# EAGLE design ESP_LoRa_ScaleSansotta (EAGLE 9.5.2)
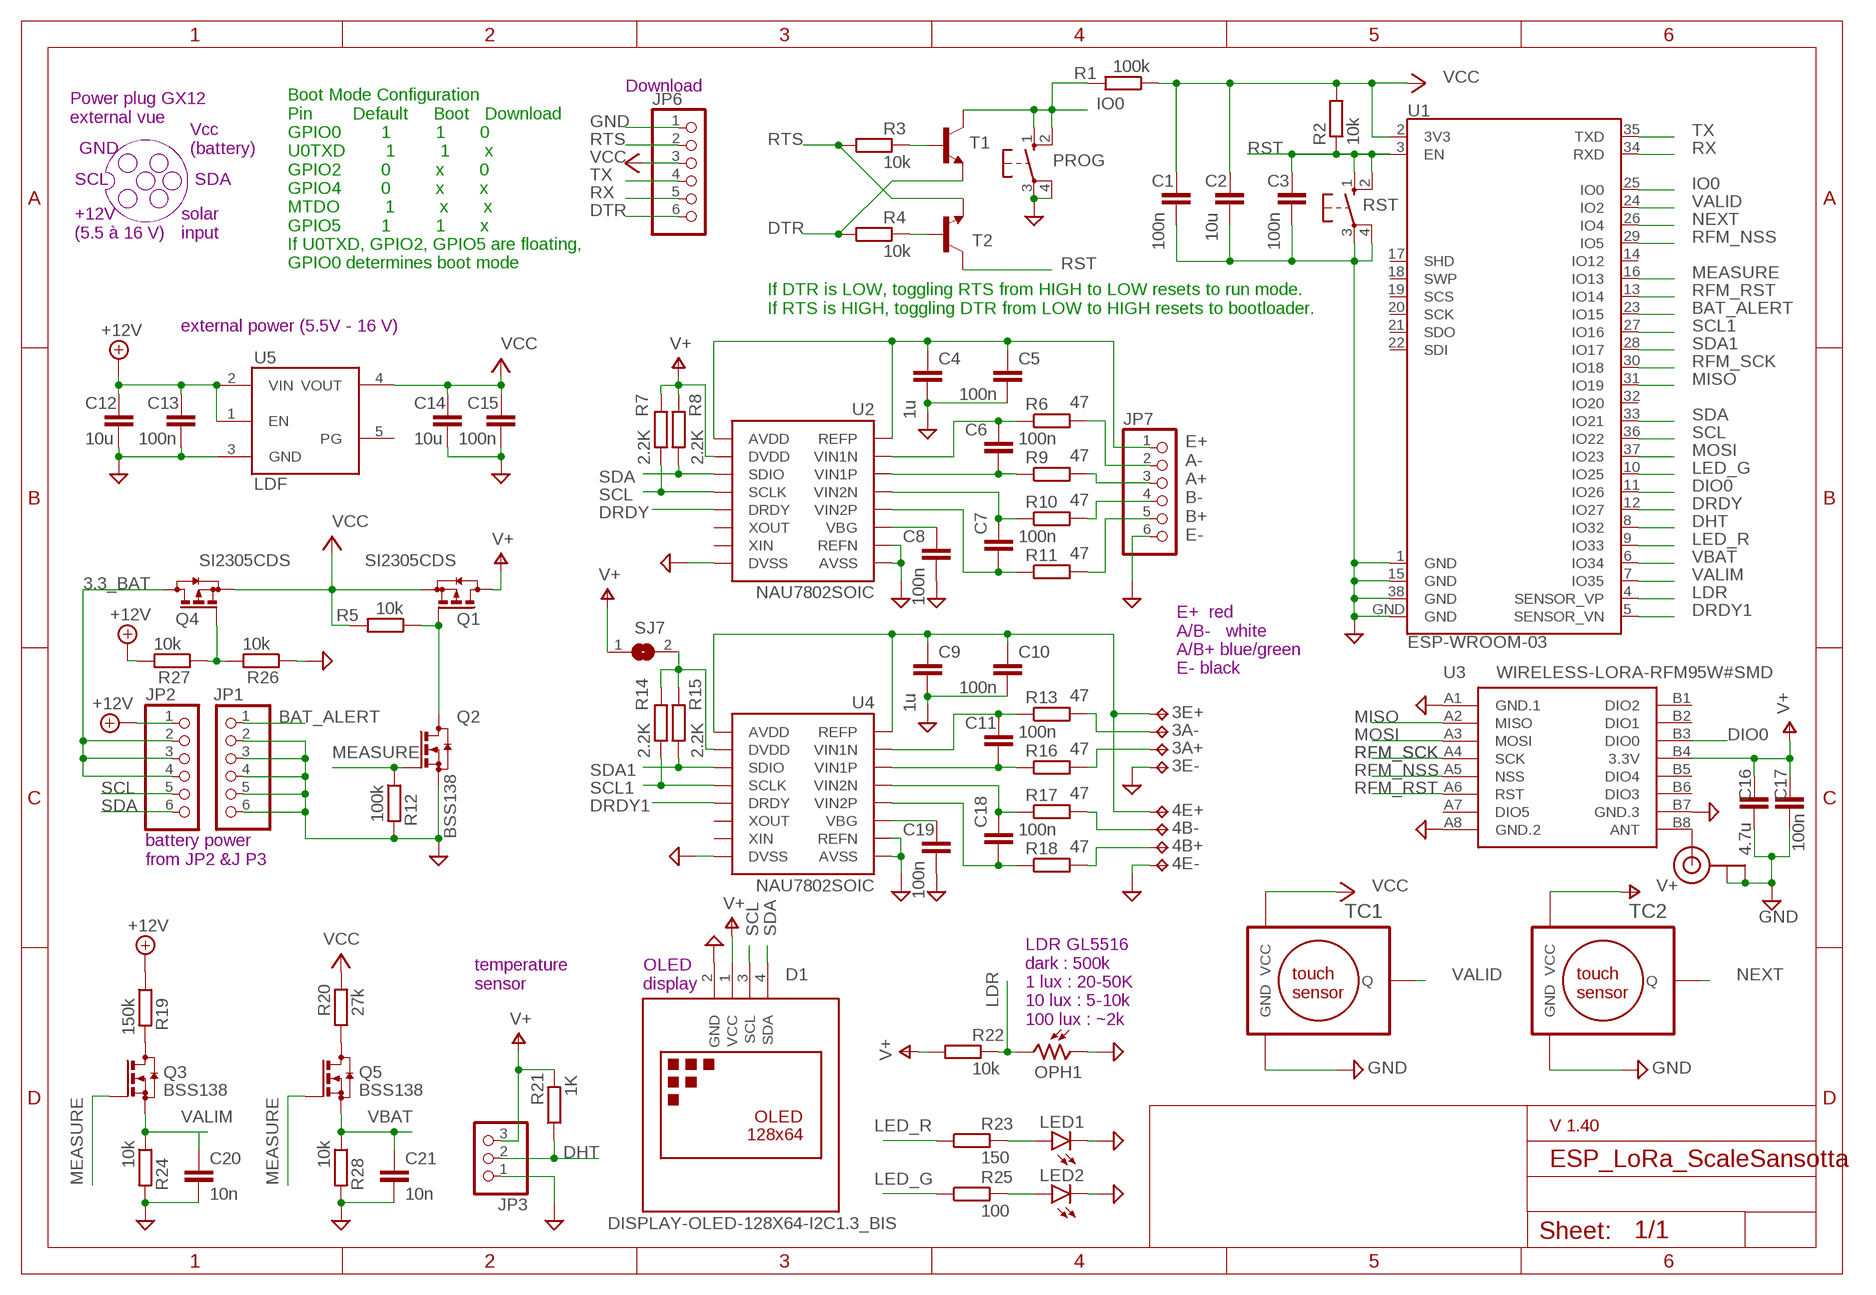
[diagram p0: schematic, sheet 1]

## Parts
3A+  TPTP17SQ  [TP17SQ]
3A-  TPTP17SQ  [TP17SQ]
3E+  TPTP17SQ  [TP17SQ]
3E-  TPTP17SQ  [TP17SQ]
4B+  TPTP17SQ  [TP17SQ]
4B-  TPTP17SQ  [TP17SQ]
4E+  TPTP17SQ  [TP17SQ]
4E-  TPTP17SQ  [TP17SQ]
C1  100n  CC1206  [C1206]
C2  10u  CC1210  [C1210]
C3  100n  CC1206  [C1206]
C4  1u  CC1210  [C1210]
C5  100n  CC1206  [C1206]
C6  100n  CC1206  [C1206]
C7  100n  CC1206  [C1206]
C8  100n  CC1206  [C1206]
C9  1u  CC1210  [C1210]
C10  100n  CC1206  [C1206]
C11  100n  CC1206  [C1206]
C12  10u  CC1210  [C1210]
C13  100n  CC1206  [C1206]
C14  10u  CC1210  [C1210]
C15  100n  CC1206  [C1206]
C16  4.7u  CC1210  [C1210]
C17  100n  CC1206  [C1206]
C18  100n  CC1206  [C1206]
C19  100n  CC1206  [C1206]
C20  10n  CC1206  [C1206]
C21  10n  CC1206  [C1206]
D1  DISPLAY-OLED-128X64-I2C1.3_BIS  [DISPLAY-OLED-128X64-1.3-I2C_BIS]
J1  U.FL  [U.FL]
JP1  PINHD-1X6  [1X06]
JP2  PINHD-1X6  [1X06]
JP3  PINHD-1X3  [1X03]
JP6  PINHD-1X6  [1X06]
JP7  PINHD-1X6  [1X06]
LED1  LEDSMT1206  [1206]
LED2  LEDSMT1206  [1206]
OPH1  VT93N2  [VT900]
PROG  10-XX  [B3F-10XX]
Q1  SI2305CDS  [SOT23]
Q2  BSS138  [SOT23]
Q3  BSS138  [SOT23]
Q4  SI2305CDS  [SOT23]
Q5  BSS138  [SOT23]
R1  100k  RR1206  [R1206]
R2  10k  RR1206  [R1206]
R3  10k  RR1206  [R1206]
R4  10k  RR1206  [R1206]
R5  10k  RR1206  [R1206]
R6  47  RR1206  [R1206]
R7  2.2K  RR1206  [R1206]
R8  2.2K  RR1206  [R1206]
R9  47  RR1206  [R1206]
R10  47  RR1206  [R1206]
R11  47  RR1206  [R1206]
R12  100k  RR1206  [R1206]
R13  47  RR1206  [R1206]
R14  2.2K  RR1206  [R1206]
R15  2.2K  RR1206  [R1206]
R16  47  RR1206  [R1206]
R17  47  RR1206  [R1206]
R18  47  RR1206  [R1206]
R19  150k  RR1206  [R1206]
R20  27k  RR1206  [R1206]
R21  1K  RR1206  [R1206]
R22  10k  RR1206  [R1206]
R23  150  RR1206  [R1206]
R24  10k  RR1206  [R1206]
R25  100  RR1206  [R1206]
R26  10k  RR1206  [R1206]
R27  10k  RR1206  [R1206]
R28  10k  RR1206  [R1206]
RST  10-XX  [B3F-10XX]
SJ7  SJ  [SJ]
T1  MMBT2222ALT1-NPN-SOT23-BEC  [SOT23-BEC]
T2  MMBT2222ALT1-NPN-SOT23-BEC  [SOT23-BEC]
TC1  TTP223R_H  [TTP233RED_H]
TC2  TTP223R_H  [TTP233RED_H]
U1  ESP-WROOM-03  [ESP-WROOM-03]
U2  NAU7802SOIC  [SO16]
U3  WIRELESS-LORA-RFM95W#SMD  [WIRELESS-LORA-RFM95W#SMD]
U4  NAU7802SOIC  [SO16]
U5  LDF3.3  [PPAK]

## Nets
3.3_BAT: JP2.2 JP2.3 JP2.4 Q4.3(D)
+12V: C12.1 C13.1 JP2.1 R19.1 R27.2 U5.1(EN) U5.2(VIN)
BAT_ALERT: JP1.1 U1.23(IO15)
DHT: JP3.2 R21.1 U1.8(IO32)
DIO0: U1.11(IO26) U3.B3(DIO0)
DRDY: U1.12(IO27) U2.12(DRDY)
DRDY1: U1.5(SENSOR_VN) U4.12(DRDY)
DTR: JP6.6 R4.1 T1.E
GND: 3E-.TP 4E-.TP C1.2 C2.2 C3.2 C4.2 C5.2 C8.2 C9.2 C10.2 C12.2 C13.2 C14.2 C15.2 C16.2 C17.2 C19.2 C20.2 C21.2 D1.2(GND) J1.1(GND) J1.2(GND) JP1.2 JP1.3 JP1.4 JP1.5 JP1.6 JP3.1 JP6.1 JP7.6 LED1.C LED2.C OPH1.1 PROG.3(P) PROG.4(P1) Q2.2(S) R12.2 R24.2 R26.1 R28.2 RST.3(P) RST.4(P1) TC1.P$3(GND) TC2.P$3(GND) U1.1(GND) U1.15(GND) U1.38(GND) U1.GND U2.7(REFN) U2.8(AVSS) U2.9(DVSS) U3.A1(GND.1) U3.A8(GND.2) U3.B7(GND.3) U4.7(REFN) U4.8(AVSS) U4.9(DVSS) U5.3(GND)
IO0: PROG.1(S) PROG.2(S1) R1.2 T1.C U1.25(IO0)
LDR: OPH1.2 R22.2 U1.4(SENSOR_VP)
LED_G: R25.1 U1.10(IO25)
LED_R: R23.1 U1.9(IO33)
MEASURE: Q2.1(G) Q3.1(G) Q5.1(G) R12.1 U1.16(IO13)
MISO: U1.31(IO19) U3.A2(MISO)
MOSI: U1.37(IO23) U3.A3(MOSI)
N$1: Q1.1(G) Q2.3(D) R5.1
N$2: Q3.3(D) R19.2
N$3: J1.3(SIGNAL) U3.B8(ANT)
N$4: R14.2 R15.2 SJ7.2 U4.15(DVDD)
N$5: Q5.3(D) R20.1
N$7: LED1.A R23.2
N$8: LED2.A R25.2
N$10: R3.2 T1.B
N$13: JP7.2 R6.2
N$14: R4.2 T2.B
N$15: C8.1 U2.6(VBG)
N$16: C19.1 U4.6(VBG)
N$17: C11.2 R16.1 U4.3(VIN1P)
N$18: C11.1 R13.1 U4.2(VIN1N)
N$19: C6.2 R9.1 U2.3(VIN1P)
N$20: C6.1 R6.1 U2.2(VIN1N)
N$21: C7.1 R10.1 U2.4(VIN2N)
N$22: C7.2 R11.1 U2.5(VIN2P)
N$24: JP7.3 R9.2
N$25: JP7.5 R11.2
N$26: JP7.4 R10.2
N$27: C18.1 R17.1 U4.4(VIN2N)
N$28: C18.2 R18.1 U4.5(VIN2P)
N$29: 4B+.TP R18.2
N$30: 4B-.TP R17.2
N$31: 3E+.TP 4E+.TP C9.1 C10.1 U4.1(REFP) U4.16(AVDD)
N$32: 3A-.TP R13.2
N$33: 3A+.TP R16.2
N$34: C4.1 C5.1 JP7.1 U2.1(REFP) U2.16(AVDD)
N$35: Q4.1(G) R26.2 R27.1
NEXT: TC2.P$2(Q) U1.26(IO4)
RFM_NSS: U1.29(IO5) U3.A5(NSS)
RFM_RST: U1.13(IO14) U3.A6(RST)
RFM_SCK: U1.30(IO18) U3.A4(SCK)
RST: C3.1 R2.1 RST.1(S) RST.2(S1) T2.C U1.3(EN)
RTS: JP6.2 R3.1 T2.E
RX: JP6.5 U1.34(RXD)
SCL: D1.3(SCL) JP2.5 R7.1 U1.36(IO22) U2.13(SCLK)
SCL1: R14.1 U1.27(IO16) U4.13(SCLK)
SDA: D1.4(SDA) JP2.6 R8.1 U1.33(IO21) U2.14(SDIO)
SDA1: R15.1 U1.28(IO17) U4.14(SDIO)
TX: JP6.4 U1.35(TXD)
V+: C16.1 C17.1 D1.1(VCC) JP3.3 Q1.3(D) R7.2 R8.2 R21.2 R22.1 SJ7.1 TC2.P$1(VCC) U2.15(DVDD) U3.B4(3.3V)
VALID: TC1.P$2(Q) U1.24(IO2)
VALIM: C20.1 Q3.2(S) R24.1 U1.7(IO35)
VBAT: C21.1 Q5.2(S) R28.1 U1.6(IO34)
VCC: C1.1 C2.1 C14.1 C15.1 JP6.3 Q1.2(S) Q4.2(S) R1.1 R2.2 R5.2 R20.2 TC1.P$1(VCC) U1.2(3V3) U5.4(VOUT)
Unconnected: U1.14(IO12) U1.17(SHD) U1.18(SWP) U1.19(SCS) U1.20(SCK) U1.21(SDO) U1.22(SDI) U1.32(IO20) U2.10(XIN) U2.11(XOUT) U3.A7(DIO5) U3.B1(DIO2) U3.B2(DIO1) U3.B5(DIO4) U3.B6(DIO3) U4.10(XIN) U4.11(XOUT) U5.5(PG)

## Notes on the sheet
- Download
- Power plug GX12
  external vue
- GND
- Vcc
  (battery)
- SCL | SDA
- +12V
  (5.5 à 16 V)
- solar 
  input
- Boot Mode Configuration
  Pin        Default     Boot   Download
  GPIO0        1         1       0
  U0TXD        1         1       x
  GPIO2        0         x       0
  GPIO4        0         x       x
  MTDO         1         x       x
  GPIO5        1         1       x
  If U0TXD, GPIO2, GPIO5 are floating, 
  GPIO0 determines boot mode
- If DTR is LOW, toggling RTS from HIGH to LOW resets to run mode.
  If RTS is HIGH, toggling DTR from LOW to HIGH resets to bootloader.
- external power (5.5V - 16 V)
- E+
  A-
  A+
  B-
  B+
  E-
- E+  red
  A/B-   white
  A/B+ blue/green
  E- black
- battery power
  from JP2 &J P3
- temperature
  sensor
- OLED 
  display
- LDR GL5516
  dark : 500k
  1 lux : 20-50K
  10 lux : 5-10k
  100 lux : ~2k
- V 1.40

## Library data of the parts
3A+ 3A- 3E+ 3E- 4B+ 4B- 4E+ 4E- = testpad:TP: Test pad
C1-C21 = eagle-ltspice:C: CAPACITOR, European symbol; SPICEMODEL: NONE; SPICEPREFIX: C
D1 = diy-modules1.8-perso:DISPLAY-OLED-128X64-I2C: 128x64 Dot Matrix OLED Module based on SSD1306 chip Variant with I2C interface More details available here: http://www.instructables.com/id/Monochrome-096-i2c-OLED-display-with-arduino-SSD13/ SSD1306 datasheet: https://cdn-shop.adafruit.com/datasheets/SSD1306.pdf Click here to find device on ebay.com <http://www.ebay.com/sch/oled+display+128x64+iic> Note: There are two variants: I2C and SPI. Search for the proper version.
J1 = microbuilder:U.FL: U.FL Antenna Connector
JP1 JP2 JP6 JP7 = pinhead:PINHD-1X6: PIN HEADER
JP3 = pinhead:PINHD-1X3: PIN HEADER
LED1 LED2 = led:LED: LED OSRAM: - CHIPLED LG R971, LG N971, LY N971, LG Q971, LY Q971, LO R971, LY R971 LH N974, LH R974 LS Q976, LO Q976, LY Q976 LO Q996 - Hyper CHIPLED LW Q18S LB Q993, LB Q99A, LB R99A - SideLED LS A670, LO A670, LY A670, LG A670, LP A670 LB A673, LV A673, LT A673, LW A673 LH A674 LY A675 LS A676, LA A676, LO A676, LY A676, LW A676 LS A679, LY A679, LG A679 - Hyper Micro SIDELED® LS Y876, LA Y876, LO Y876, LY Y876 LT Y87S - SmartLED LW L88C, LW L88S LB L89C, LB L89S, LG L890 LS L89K, LO L89K, LY L89K LS L896, LA L896, LO L896, LY L896 - TOPLED LS T670, LO T670, LY T670, LG T670, LP T670 LSG T670, LSP T670, LSY T670, LOP T670, LYG T670 LG T671, LOG T671, LSG T671 LB T673, LV T673, LT T673, LW T673 LH T674 LS T676, LA T676, LO T676, LY T676, LB T676, LH T676, LSB T676, LW T676 LB T67C, LV T67C, LT T67C, LS T67K, LO T67K, LY T67K, LW E67C LS E67B, LA E67B, LO E67B, LY E67B, LB E67C, LV E67C, LT E67C LW T67C LS T679, LY T679, LG T679 LS T770, LO T770, LY T770, LG T770, LP T770 LB T773, LV T773, LT T773, LW T773 LH T774 LS E675, LA E675, LY E675, LS T675 LS T776, LA T776, LO T776, LY T776, LB T776 LHGB T686 LT T68C, LB T68C - Hyper Mini TOPLED® LB M676 - Mini TOPLED Santana® LG M470 LS M47K, LO M47K, LY M47K Source: http://www.osram.convergy.de LUXEON: - LUMILED® LXK2-PW12-R00, LXK2-PW12-S00, LXK2-PW14-U00, LXK2-PW14-V00 LXK2-PM12-R00, LXK2-PM12-S00, LXK2-PM14-U00 LXK2-PE12-Q00, LXK2-PE12-R00, LXK2-PE12-S00, LXK2-PE14-T00, LXK2-PE14-U00 LXK2-PB12-K00, LXK2-PB12-L00, LXK2-PB12-M00, LXK2-PB14-N00, LXK2-PB14-P00, LXK2-PB14-Q00 LXK2-PR12-L00, LXK2-PR12-M00, LXK2-PR14-Q00, LXK2-PR14-R00 LXK2-PD12-Q00, LXK2-PD12-R00, LXK2-PD12-S00 LXK2-PH12-R00, LXK2-PH12-S00 LXK2-PL12-P00, LXK2-PL12-Q00, LXK2-PL12-R00 Source: www.luxeon.com KINGBRIGHT: KA-3528ASYC Source: www.kingbright.com
OPH1 = photo-elements:VT9: Photoconductive Cell VT900 Series Source: http://optoelectronics.perkinelmer.com/content/Datasheets/DTS_vt900seriesdatasheet.pdf
PROG RST = switch-omron:10-XX: OMRON SWITCH; MPN: B3F-1000; OC_FARNELL: 176432; OC_NEWARK: 36M3542
Q1 Q4 = transistor-small-signal-perso:SI2305CDS: P-CHANNEL MOS FET
Q2 Q3 Q5 = detect:BSS138: N-CHANNEL MOS FET
R1-R28 = eagle-ltspice:R: RESISTOR, European symbol; SPICEMODEL: NONE; SPICEPREFIX: R
SJ7 = jumper:SJ: SMD solder JUMPER
T1 T2 = transistor:*-NPN-: NPN Transistror BF959 corrected 2008.03.06
TC1 TC2 = esp32-lora:TTP223: Touch Key Switch
U1 = esp32-sparkfun (1):ESP-WROOM-03; OC_FARNELL: unknown
U2 U4 = SparkFun-IC-Conversion:NAU7802: 24-bit load cell conversion IC with I2C interface in SOIC-16 package. Similar to HX711 but with true I2C interface.; PROD_ID: IC-14299
U3 = diy-modules:WIRELESS-LORA-RFM95W: 868/915 MHz LoRa Radio Transceiver Module based on SX1276 chip Click here to find device on ebay.com <http://www.ebay.com/sch/RFM95W+transceiver>
U5 = LDO:LDF: LDFxx 1 A very low drop voltage regulator

## Board
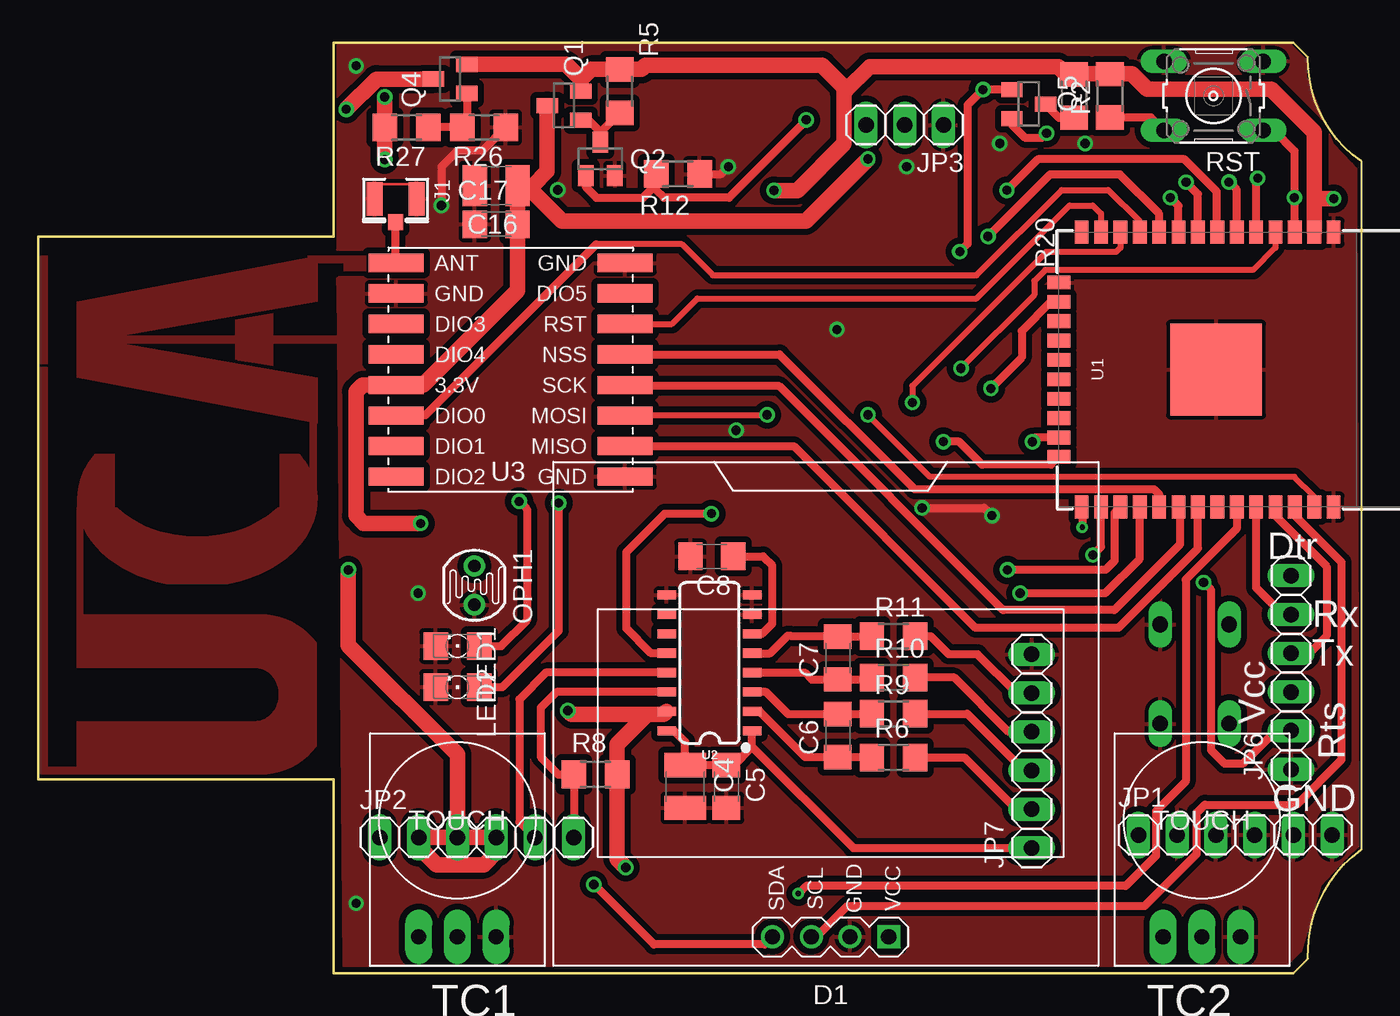
[diagram p1: board, top side]
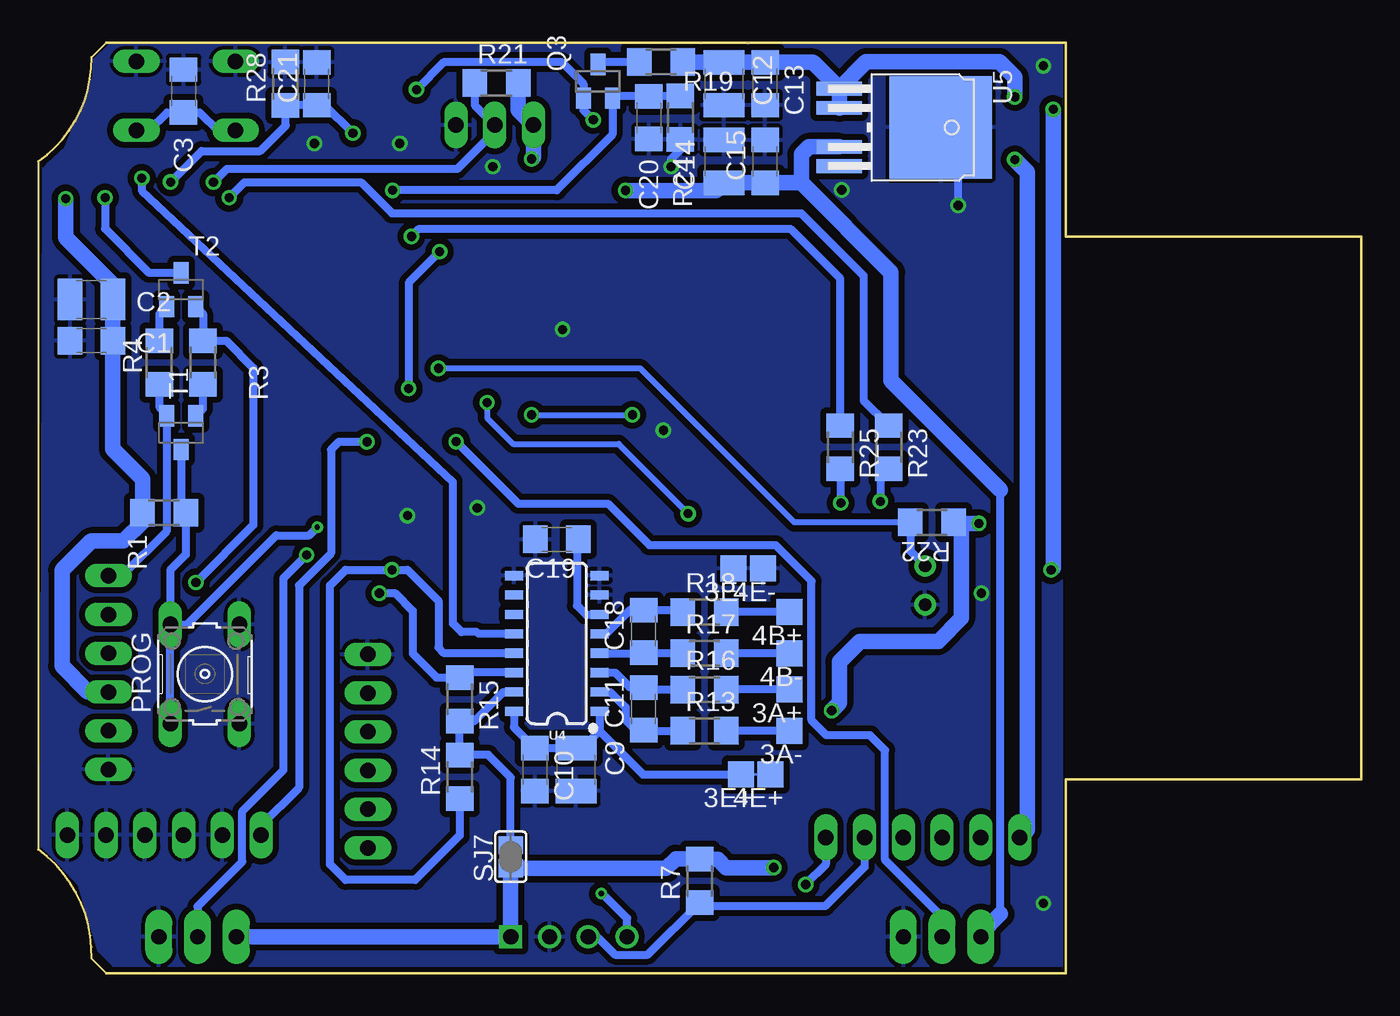
[diagram p2: board, bottom side, seen from below]

Size 86.68 x 60.96 mm. Coordinates in mm from the lower left corner, seen from the top.
Outline: 19.37,0 19.37,12.7 0,12.7 0,48.26 19.37,48.26 19.37,60.96 82.23,60.96 83.19,60.01 arc56 86.68,53.18 86.68,8.1 arc56 83.19,0.95 82.23,0 19.37,0
Copper layers (1*16): Top 0.035mm / dielectric 1.5mm / Bottom 0.035mm
Design rules "default *": minimum track width 6mil, minimum drill 0.35mm, track to track 6mil, track to pad 6mil, pad to pad 6mil, via to via 6mil, smd to smd 6mil, copper to edge 0mil, drill to drill 6mil, minimum pad ring 10mil, minimum via ring 8mil, stop-mask expansion 4mil, vias tented up to drill 0mil, thermal gap 10mil

### Footprints (pad centres in the part's own frame; a part is rotated, then mirrored left to right if it is on the bottom)
TP17SQ = smd 1.7 x 1.7: TP 0,0
C1206 = smd 1.6 x 1.8: 1 -1.4,0; 2 1.4,0
C1210 = smd 1.6 x 2.7: 1 -1.4,0; 2 1.4,0
DISPLAY-OLED-128X64-1.3-I2C_BIS = drill 1 square: 1 -3.81,14.605 | drill 1: 2 -1.27,14.605; 3 1.27,14.605; 4 3.81,14.605
U.FL = smd 2.2 x 1.05: 1 0,1.375; 2 0,-1.375 | smd 1.05 x 1: 3 1.525,0
1X06 = drill 1.016 long: 1 -6.35,0; 2 -3.81,0; 3 -1.27,0; 4 1.27,0; 5 3.81,0; 6 6.35,0
1X03 = drill 1.016 long: 1 -2.54,0; 2 0,0; 3 2.54,0
1206 = smd 1.6 x 1.803: A -1.422,0; C 1.422,0
VT900 = drill 0.8 pad 1.4: 1 -1.27,0; 2 1.27,0
B3F-10XX = drill 1.016 long: 1 -3.251,2.261; 2 3.251,2.261; 3 -3.251,-2.261; 4 3.251,-2.261
SOT23 = smd 1 x 1.4: 1 -0.95,-1.1; 2 0.95,-1.1; 3 0,1.1
R1206 = smd 1.6 x 1.803: 1 -1.422,0; 2 1.422,0
SJ = smd 1.168 x 1.6: 1 -0.762,0; 2 0.762,0
SOT23-BEC = smd 1 x 1.4: B -0.95,-1.1; C 0,1.1; E 0.95,-1.1
TTP233RED_H = drill 1 pad 1.778 long: P$1 1.905,2.54; P$2 1.905,0; P$3 1.905,-2.54
ESP-WROOM-03 = smd 0.9 x 1.5: 1 7.7,9; 2 6.43,9; 3 5.16,9; 4 3.89,9; 5 2.62,9; 6 1.35,9; 7 0.08,9; 8 -1.19,9; 9 -2.46,9; 10 -3.73,9; 11 -5,9; 12 -6.27,9; 13 -7.54,9; 14 -8.81,9; 25 -8.81,-9; 26 -7.54,-9; 27 -6.27,-9; 28 -5,-9; 29 -3.73,-9; 30 -2.46,-9; 31 -1.19,-9; 32 0.08,-9; 33 1.35,-9; 34 2.62,-9; 35 3.89,-9; 36 5.16,-9; 37 6.43,-9; 38 7.7,-9 | smd 1.5 x 0.9: 15 -10.3,5.715; 16 -10.3,4.445; 17 -10.3,3.175; 18 -10.3,1.905; 19 -10.3,0.635; 20 -10.3,-0.635; 21 -10.3,-1.905; 22 -10.3,-3.175; 23 -10.3,-4.445; 24 -10.3,-5.715 | smd 6 x 6: GND 0,0
SO16 = smd 0.6 x 1.2: 1 -4.445,-2.8; 2 -3.175,-2.8; 3 -1.905,-2.8; 4 -0.635,-2.8; 5 0.635,-2.8; 6 1.905,-2.8; 7 3.175,-2.8; 8 4.445,-2.8; 9 4.445,2.8; 10 3.175,2.8; 11 1.905,2.8; 12 0.635,2.8; 13 -0.635,2.8; 14 -1.905,2.8; 15 -3.175,2.8; 16 -4.445,2.8
WIRELESS-LORA-RFM95W#SMD = smd 3.6 x 1.2: A1 -7.5,7; A2 -7.5,5; A3 -7.5,3; A4 -7.5,1; A5 -7.5,-1; A6 -7.5,-3; A7 -7.5,-5; A8 -7.5,-7; B1 7.5,7; B2 7.5,5; B3 7.5,3; B4 7.5,1; B5 7.5,-1; B6 7.5,-3; B7 7.5,-5; B8 7.5,-7
PPAK = smd 0.9 x 3: 1 -2.54,-1.5; 2 -1.27,-1.5; 4 1.27,-1.5; 5 2.54,-1.5 | smd 6.7 x 6.7: 3 0,5.15

### Placement (x,y rotation side)
3A+  37.47,18.57 180 bottom
3A-  37.47,15.88 180 bottom
3E+  40.64,13.02 180 bottom
3E-  41.12,26.51 180 bottom
4B+  37.47,23.65 180 bottom
4B-  37.47,20.95 180 bottom
4E+  38.69,13.02 180 bottom
4E-  39.21,26.51 180 bottom
C1  83.19,41.43 180 bottom
C2  83.19,44.13 180 bottom
C3  77.15,57.78 90 bottom
C4  42.39,12.22 270 top
C5  45.09,12.22 270 top
C6  52.39,15.56 90 top
C7  52.39,20.64 90 top
C8  44.13,27.3 180 top
C9  51.44,13.34 270 bottom
C10  54.13,13.34 270 bottom
C11  47.02,17.3 90 bottom
C12  41.75,58.26 270 bottom
C13  39.05,58.26 270 bottom
C14  41.75,53.18 90 bottom
C15  39.05,53.18 90 bottom
C16  30,51.59 180 top
C17  30,49.05 180 top
C18  47.02,22.38 90 bottom
C19  52.7,28.42 180 bottom
C20  46.67,56.04 270 bottom
C21  68.42,58.26 90 bottom
D1  51.91,16.99 180 top
J1  23.41,50.73 270 top
JP1  78.42,9.05 0 top
JP2  28.73,8.89 0 top
JP3  56.77,55.56 180 top
JP6  82.07,19.68 90 top
JP7  65.09,14.54 90 top
LED1  27.46,21.43 180 top
LED2  27.46,18.73 180 top
OPH1  28.57,25.4 90 top
PROG  75.76,19.59 90 bottom
Q1  34.45,56.83 90 top
Q2  36.83,53.34 0 top
Q3  50.01,58.42 0 bottom
Q4  26.99,58.58 90 top
Q5  64.89,56.93 270 top
R1  78.42,30.16 0 bottom
R2  70.2,57.47 90 top
R3  75.88,40.01 270 bottom
R4  78.74,40.01 90 bottom
R5  38.1,57.78 90 top
R6  56.04,14.13 0 top
R7  43.34,6.03 90 bottom
R8  36.51,13.02 0 top
R9  56.04,16.99 0 top
R10  56.04,19.37 0 top
R11  56.04,22.07 0 top
R12  41.91,52.36 0 top
R13  43.02,15.88 0 bottom
R14  59.05,12.86 90 bottom
R15  59.05,17.94 270 bottom
R16  43.02,18.57 0 bottom
R17  43.02,20.95 0 bottom
R18  43.02,23.65 0 bottom
R19  45.88,59.69 180 bottom
R20  67.86,57.46 90 top
R21  56.66,58.3 0 bottom
R22  28.13,29.53 180 bottom
R23  30.96,34.45 270 bottom
R24  44.61,56.04 270 bottom
R25  34.13,34.45 270 bottom
R26  29.21,55.4 180 top
R27  24.13,55.4 180 top
R28  70.48,58.26 90 bottom
RST  76.99,57.47 180 top
SJ7  55.72,7.62 90 bottom
T1  77.31,35.4 180 bottom
T2  77.31,44.77 0 bottom
TC1  27.46,0.48 90 top
TC2  76.23,0.48 90 top
U1  77.16,39.54 0 top
U2  43.97,20.32 90 top
U3  30.96,39.53 180 top
U4  52.7,21.59 90 bottom
U5  32.7,55.4 270 bottom

### Tracks (layer width: path | path; a pad name or v marks a point on that pad's centre or on a via)
3.3_BAT  (via drill 0.6)
  Top 1.016: JP2.3 JP2.2 24.92,8.28 26.1,7.1 29.2,7.1 30,7.9 JP2.4 JP2.3 | v20.18,56.59 22.17,58.58 Q4.3 | JP2.3 27.46,14.33 20.32,21.47 v20.32,26.42
  Bottom 0.508: 20.18,26.55 v20.32,26.42
  Bottom 1.016: v20.18,56.59 20.18,26.55
+12V  (via drill 0.6)
  Top 0.152: 22.7,55.37 R27.2
  Top 1.016: v22.7,57.4 R27.2 | v22.7,53.3 22.7,55.37
  Bottom 0.152: 41.66,59.66 C12.1
  Bottom 0.508: C12.1 41.78,59.69
  Bottom 1.016: 41.78,59.69 R19.1 | 41.66,59.66 C13.1 35.92,59.66 U5.1 | U5.1 U5.2 | U5.1 32.45,59.7 23.7,59.7 22.7,58.7 v22.7,57.4 | JP2.1 21.88,9.4 21.88,52.48 v22.7,53.3
ANT
  pour Top: 14.99,13 0.14,13 0.14,39.7 0.64,39.7 0.64,13.5 2.54,13.5 2.54,16.5 14.19,16.5 14.32,16.51 14.46,16.53 14.59,16.56 14.73,16.61 14.85,16.67 14.97,16.74 15.09,16.82 15.2,16.91 15.3,17.02 15.39,17.13 15.48,17.25 15.55,17.38 15.61,17.51 15.67,17.65 15.71,17.8 15.74,17.95 15.76,18.1 15.76,18.25 15.76,18.41 15.74,18.56 15.71,18.71 15.67,18.85 15.61,18.99 15.55,19.13 15.48,19.25 15.39,19.38 15.3,19.49 15.2,19.59 15.09,19.69 14.97,19.77 14.85,19.84 14.73,19.9 14.59,19.94 14.46,19.98 14.32,20 14.19,20 2.54,20 2.54,30.5 2.57,30.5 2.55,31.11 2.61,31.73 2.75,32.32 2.99,32.92 3.31,33.49 3.72,34 5.03,34 5.03,30.5 5.17,30.5 5.5,30.21 5.85,29.95 6.22,29.7 6.63,29.48 7.06,29.27 7.5,29.1 7.96,28.95 8.44,28.82 8.92,28.73 9.42,28.66 9.92,28.61 10.42,28.6 10.92,28.61 11.42,28.66 11.92,28.73 12.41,28.82 12.88,28.95 13.35,29.1 13.78,29.27 14.21,29.48 14.62,29.7 14.99,29.95 15.34,30.21 15.67,30.5 15.82,30.5 15.82,34 17.13,34 17.25,33.85 17.37,33.69 17.49,33.53 17.59,33.37 17.69,33.21 17.79,33.04 17.79,36.1 2.54,39 2.54,44 17.64,46.87 17.64,47 20.14,47 20.14,46.99 23.99,46.99 23.99,45.99 19.99,45.99 19.99,46.5 18.31,46.5 18.31,44 5.61,41.75 12.91,41.75 12.91,42.8 15.4,43.25 15.4,41.75 19.99,41.75 19.99,42 20.39,42 20.39,41 19.99,41 19.99,41.25 15.4,41.25 15.4,39.75 14.21,39.97 13.08,40.14 13.08,40.17 12.91,40.2 12.91,41.25 5.61,41.25 18.31,39 18.31,36 18.24,36.02 18.24,31.76 18.3,31.22 18.29,30.67 18.21,30.13 18.06,29.58 17.83,29.06 17.55,28.56 17.18,28.07 16.76,27.62 16.3,27.2 15.76,26.8 15.17,26.46 14.57,26.15 13.89,25.88 13.2,25.66 12.49,25.5 8.35,25.5 7.75,25.64 7.15,25.81 6.57,26.03 6.03,26.27 5.51,26.54 5.02,26.85 4.58,27.18 4.16,27.53 3.79,27.92 3.47,28.32 3.19,28.74 2.95,29.18 2.95,23.5 14.99,23.5 14.99,23.49 15.4,23.43 15.81,23.34 16.21,23.21 16.59,23.03 16.96,22.82 17.31,22.58 17.65,22.3 17.96,21.99 18.24,21.65 18.24,14.85 17.96,14.52 17.65,14.2 17.31,13.93 16.96,13.68 16.59,13.47 16.21,13.3 15.81,13.17 15.4,13.07 14.99,13.02
ANT1
  pour Top: 0.64,39.9 0.14,39.9 0.14,47 0.64,47
BAT_ALERT  (via drill 0.6)
  Top 0.508: U1.23 65.34,35.09 65.14,34.89 v65.14,34.81
  Bottom 0.508: JP1.1 72.07,9.66 69.6,12.14 69.6,25.4 67.5,27.5 67.5,34.3 66.99,34.81 v65.14,34.81
DHT  (via drill 0.6)
  Top 0.508: U1.8 75.97,51.03 v75.19,51.82
  Bottom 0.508: R21.1 58.08,56.87 JP3.2 56.77,55.13 59.22,52.68 74.33,52.68 v75.19,51.82
DIO0
  Top 0.152: U1.11 72.16,48.26
  Top 0.406: 72.16,48.26 72.16,49.25 70.1,51.31 67.06,51.31 61.47,45.72 44.2,45.72 42.16,47.75 36.58,47.75
  Top 0.508: U3.B3 25.35,36.53 36.58,47.75
DRDY  (via drill 0.6)
  Top 0.406: U1.12 70.89,47.52 70.61,47.24 66.04,47.24 57.27,38.47 v57.27,37.38
  Top 0.508: U2.12 40.16,20.95 38.51,22.6 38.51,27.56 41.05,30.1 v44.1,30.1
  Bottom 0.406: v57.27,37.38 57.27,36.36 55.57,34.66 48.65,34.66 44.1,30.12 v44.1,30.1
DRDY1  (via drill 0.6)
  Top 0.508: U1.5 79.78,51.97 v79.89,52.08
  Bottom 0.152: 57.81,22.23 57.93,22.34
  Bottom 0.508: U4.12 57.81,22.23 | 57.93,22.34 58.94,22.34 59.51,22.9 59.51,32.17 79.89,51.27 v79.89,52.08
DTR
  Bottom 0.508: R4.1 78.74,37.08 78.26,36.6 T1.E 78.26,28.95 81.17,26.04 JP6.6
GND  (via drill 0.6)
  Top 0.152: J1.2 22.51,51.2 22.51,51.65 22.56,51.69 24.27,51.69 24.32,51.65 24.32,51.2 J1.1
  Top 0.508: R26.1 29.11,53.88 27.46,53.88 26.42,52.83 v26.42,50.29 | R12.2 44.74,52.36 v45.21,52.83 | v57.91,30.48 61.98,30.48 v62.48,29.97
  Bottom 0.152: 44.57,54.58 R24.2
  Bottom 0.508: U5.3 26.42,54.27 v26.42,50.29 | v45.21,52.83 45.21,53.34 44.57,53.98 44.57,54.58
  other vias: 45.72,35.56 24.89,24.89 56.9,52.83 20.83,4.57 52.32,42.16 62.99,54.36 20.83,59.44 34.04,51.31 68.58,54.36
  pour Top (isolate 0.406): 20.01,0.48 19.61,45.09 19.6,45.1 19.6,45.5 19.7,45.6 25.7,45.6 25.7,47.4 19.6,47.4 19.6,47.43 19.6,60.8 82.07,60.8 83.03,59.85 83.03,58.74 84.78,54.36 86.04,53.02 86.36,52.7 86.48,8.3 85.69,7.56 83.98,5.71 82.71,1.43 81.76,0.48
  pour Bottom (isolate 0.406): 19.6,0.48 19.6,60.9 81.97,60.9 83.03,59.85 83.03,58.74 84.87,54.12 86.04,53.02 86.36,52.7 86.48,8.3 85.69,7.56 83.98,5.71 82.71,1.43 81.76,0.48
IO0  (via drill 0.35)
  Top 0.508: U1.25 68.4,30.49 v68.4,29.2
  Bottom 0.152: 78.02,22.78 PROG.2
  Bottom 0.508: T1.C 77.31,30.47 R1.2 77,27.41 78.02,26.4 PROG.2 76.92,22.84 71.08,28.68 68.92,28.68 v68.4,29.2 | PROG.1 78.02,22.78
LDR  (via drill 0.6)
  Top 0.406: U1.4 81.05,47.52 79.58,46.06 65.97,46.06 65.25,45.34 65.25,44.42 v60.45,39.62
  Bottom 0.406: R22.2 37.15,29.53 47.24,39.62 v60.45,39.62
  Bottom 0.508: R22.2 29.55,27.65 OPH1.2
LED_G  (via drill 0.6)
  Top 0.508: U1.10 73.43,49.75 70.86,52.32 66.29,52.32 v62.22,48.26
  Bottom 0.508: R25.1 34.13,45.49 37.41,48.77 61.72,48.77 v62.22,48.26
LED_R  (via drill 0.6)
  Top 0.508: v74.17,50.8 74.7,50.27 U1.9
  Bottom 0.508: R23.1 32.61,37.52 32.61,45.68 36.71,49.78 63.5,49.78 65.53,51.82 73.15,51.82 v74.17,50.8
MEASURE  (via drill 0.6)
  Top 0.508: Q5.1 v61.9,57.88 v61.89,57.88 60.88,56.88 60.88,47.78 v60.38,47.27 | v50.31,55.9 50.31,55.84 45.27,50.8 41,50.8 40.49,51.31 40.49,51.66 | Q2.1 35.88,51.5 36.58,50.8 39.62,50.8 40.49,51.66 | U1.16 66.36,43.98 64.44,42.07 64.44,40.34 v62.41,38.3 | 40.49,51.66 R12.1
  Bottom 0.508: v60.38,47.27 62.41,45.24 v62.41,38.3 | v61.89,57.88 60.08,59.7 52.4,59.7 50.96,58.26 Q3.1 50.96,56.54 v50.31,55.9
MISO
  Top 0.508: U3.A2 49.5,34.53 61.41,22.62 70.77,22.62 75.97,27.83 U1.31
MOSI  (via drill 0.6)
  Top 0.406: U1.37 83.59,31.21 82.3,32.51 58.42,32.51 v54.36,36.58 | v47.75,36.58 47.7,36.53 U3.A3
  Bottom 0.406: v54.36,36.58 v47.75,36.58
N$1
  Top 0.508: R5.1 36.83,55.09 | 36.83,55.09 Q2.3 | Q1.1 36.04,55.88 36.83,55.09
N$2
  Bottom 0.508: R19.2 49.84,59.69 Q3.3
N$3
  Top 0.508: U3.B8 23.41,46.57 J1.3
N$4
  Bottom 0.152: 59.04,14.3 R14.2 | U4.15 56.19,18.41 | 59.04,16.5 R15.2
  Bottom 0.508: SJ7.2 55.72,12.82 57.2,14.3 59.04,14.3 | R14.2 R15.2 | 56.19,18.41 58.11,16.5 59.04,16.5
N$5
  Top 0.508: R20.1 66.88,56.04 Q5.3
N$7  (via drill 0.6)
  Top 0.508: v31.51,30.9 32.02,30.39 32.02,23.12 30.33,21.43 LED1.A
  Bottom 0.152: R23.2 31.51,32.48
  Bottom 0.508: 31.51,32.48 v31.51,30.9
N$8  (via drill 0.6)
  Top 0.508: v34.1,30.8 34.1,22.42 30.41,18.73 LED2.A
  Bottom 0.508: R25.2 34.13,30.83 v34.1,30.8
N$10
  Bottom 0.508: R3.2 75.88,36.98 T1.B
N$13
  Top 0.508: R6.2 60.67,14.13 64.07,10.73 JP7.2
N$14
  Bottom 0.508: T2.B 78.74,43.19 R4.2
N$15
  Top 0.508: C8.1 47.49,27.3 48.1,26.7 48.1,22.9 47.42,22.23 U2.6
N$16
  Bottom 0.152: C19.1 51.38,28.34
  Bottom 0.508: 51.38,28.34 51.38,24.08 50.8,23.5 U4.6
N$17
  Bottom 0.152: 47.06,18.75 C11.2 46.89,18.57
  Bottom 0.508: 46.89,18.57 R16.1 | U4.3 48.88,19.68 47.95,18.75 47.06,18.75
N$18
  Bottom 0.152: C11.1 46.99,15.88
  Bottom 0.508: 46.99,15.88 R13.1 | U4.2 49.21,18.41 48.2,17.41 48.2,16.6 47.5,15.9 C11.1
N$19
  Top 0.152: R9.1 54.59,16.96
  Top 0.508: U2.3 47.69,18.41 49.14,16.96 C6.2 54.59,16.96
N$20
  Top 0.152: 54.59,14.16 R6.1
  Top 0.508: 54.59,14.16 C6.1 50.24,14.16 47.26,17.14 U2.2
N$21
  Top 0.152: 54.49,19.24 R10.1
  Top 0.508: U2.4 50.22,19.68 50.66,19.24 C7.1 54.49,19.24
N$22
  Top 0.152: 49.1,22.1 49.28,22.1 | C7.2 52.36,22.06 R11.1
  Top 0.508: 49.1,22.1 47.95,20.95 U2.5 | 49.28,22.1 52.33,22.1 52.36,22.06 | C7.2 52.42,22.07 R11.1
N$24
  Top 0.508: R9.2 60.87,16.99 64.58,13.27 JP7.3
N$25
  Top 0.508: JP7.5 64.07,18.35 61.53,20.89 59.65,20.89 58.48,22.07 R11.2
N$26
  Top 0.508: JP7.4 63.56,15.81 60.01,19.37 R10.2
N$27
  Bottom 0.152: 44.47,20.98 R17.1 | 47.05,20.95 C18.1
  Bottom 0.508: C18.1 44.47,20.98 | U4.4 47.05,20.95
N$28
  Bottom 0.152: 44.57,23.78 R18.1 | 47.04,23.8 C18.2
  Bottom 0.508: C18.2 44.57,23.78 | U4.5 49.48,22.23 47.9,23.8 47.04,23.8
N$29
  Bottom 0.508: 4B+.TP R18.2
N$30
  Bottom 0.508: 4B-.TP R17.2
N$31
  Bottom 0.152: 51.03,14.73 C9.1 | 4E+.TP 3E+.TP
  Bottom 0.508: U4.1 49.91,15.87 | 51.03,14.73 49.91,15.87 | U4.16 55.51,16.11 C10.1 C9.1 | 49.91,15.87 47.06,13.02 3E+.TP
N$32
  Bottom 0.508: 3A-.TP R13.2
N$33
  Bottom 0.508: 3A+.TP R16.2
N$34
  Top 0.508: U2.16 41.66,15.88 42.39,15.15 C4.1 C5.1 45.59,13.62 46.77,14.81 | 46.77,14.81 U2.1 | 46.77,14.81 53.4,8.19 JP7.1
N$35
  Top 0.152: 25.91,55.4 R27.1
  Top 0.508: 25.91,55.4 R26.2 28.09,55.7 Q4.1
NEXT  (via drill 0.6)
  Top 0.508: v69.09,27.39 69.62,27.92 U1.26
  Bottom 0.508: TC2.P$2 76.23,4.37 73.3,7.3 73.3,10.61 70.62,13.29 70.62,25.87 v69.09,27.39
RFM_NSS
  Top 0.508: U3.A5 48.58,40.53 57.4,31.7 73.1,31.7 73.43,31.37 U1.29
RFM_RST
  Top 0.406: U3.A6 41.51,42.53 43.18,44.2 61.47,44.2 67.56,50.29 69.09,50.29 69.62,49.76 U1.13
RFM_SCK
  Top 0.508: U1.30 74.8,30.44 74.8,28.09 70.49,23.79 63.21,23.79 48.55,38.45 38.54,38.45 U3.A4
RST  (via drill 0.6)
  Top 0.508: RST.2 72.9,56.05 R2.1 | U1.3 82.3,48.54 v82.3,50.8 82.3,53.85 80.94,55.21 RST.1
  Bottom 0.508: RST.2 74.92,55.21 76.1,56.38 C3.1 78.23,56.38 79.41,55.21 RST.1 | v82.3,50.8 82.3,48.77 79.39,45.87 T2.C
RTS  (via drill 0.6)
  Top 0.508: v76.34,25.59 76.85,25.08 76.85,14.59 77.72,13.72 78.9,13.72 81.06,15.88 JP6.2
  Bottom 0.152: 75.88,41.66 R3.1
  Bottom 0.508: T2.E 75.88,43.19 75.88,41.66 | R3.1 74.36,41.43 72.58,39.65 72.58,29.35 v76.34,25.59
RX
  Top 0.508: JP6.5 81.52,23.5 79.78,25.23 U1.34
SCL
  Top 0.508: U2.13 33.27,19.68 31.53,17.94 31.53,9.91 JP2.5 | D1.3 51,2.38 53.02,4.4 72.49,4.4 75.9,7.81 75.9,10.5 76.44,11.04 82.44,11.04 85.39,13.99 85.39,26.9 82.32,29.97 U1.36
  Bottom 0.508: D1.3 50.07,2.38 48.89,1.2 46.75,1.2 R7.1 43.12,4.39 35.1,4.39 32.54,6.96 JP2.5
SCL1  (via drill 0.6)
  Top 0.508: U1.27 70.51,30.15 70.51,27.02 69.91,26.42 v63.5,26.42
  Bottom 0.508: U4.13 60.07,20.95 60.45,21.34 60.45,24.38 62.48,26.42 v63.5,26.42 66.55,26.42 67.56,25.4 67.56,7.11 66.55,6.1 61.98,6.1 59.05,9.02 R14.1
SDA  (via drill 0.35, 0.6)
  Top 0.152: JP2.6
  Top 0.508: JP2.6 R8.1 34.07,13.02 32.92,14.17 32.92,17.38 33.95,18.41 U2.14 | U1.33 78.51,29.11 75.17,25.77 75.17,12.55 73.24,10.62 73.24,7.71 71.25,5.72 50.31,5.72 v49.8,5.21 | v36.4,5.8 40.33,1.87 47.59,1.87 D1.4
  Bottom 0.152: 48.1,3.6
  Bottom 0.508: D1.4 48.1,3.6 | JP2.6 35.08,7.12 v36.4,5.8 | v49.8,5.21 49.71,5.21 48.1,3.6
SDA1  (via drill 0.6)
  Top 0.508: v64.32,24.89 69.91,24.89 72.16,27.14 U1.28
  Bottom 0.508: U4.14 58.73,19.68 R15.1 60.58,19.36 62.15,20.93 62.15,23.73 63.31,24.89 v64.32,24.89
TX
  Top 0.508: U1.35 81.05,29.97 84.4,26.62 84.4,22.1 83.25,20.95 JP6.4
V+  (via drill 0.6)
  Top 0.508: 32.42,51.59 32,51.59 C16.1
  Top 1.016: C16.1 C17.1 31.4,44.72 25.21,38.53 U3.B4 21.26,38.53 20.83,38.1 20.83,29.97 21.34,29.46 v25.05,29.46 | v38.49,6.92 37.93,7.47 R8.2 37.93,14.98 39.9,16.95 | v34.7,17.19 34.95,16.95 39.9,16.95 | Q1.3 33.35,52.52 32.42,51.59 | 39.9,16.95 40.97,16.95 U2.15 | v54.36,53.34 50.29,49.28 34.32,49.28 32,51.59
  Bottom 0.152: R7.2 43.3,7.46 43.35,7.5 | v38.49,6.92 v38.5,6.91 | R22.1 26.71,29.46
  Bottom 1.016: TC2.P$1 D1.1 SJ7.1 45.54,6.86 44.9,7.5 43.35,7.5 | R7.2 42.15,7.46 41.61,6.91 v38.5,6.91 | 26.2,29.46 26.2,23.25 27.71,21.74 32.86,21.74 34.2,20.4 34.2,17.69 v34.7,17.19 | R21.2 55.23,56.57 JP3.3 54.23,53.47 v54.36,53.34 | v25.05,29.46 26.2,29.46 | 26.2,29.46 26.71,29.46
VALID  (via drill 0.6)
  Top 0.508: U1.24 66.36,33.31 61.82,33.31 60.32,34.82 v59.3,34.82
  Bottom 0.508: TC1.P$2 27.46,3.68 31.2,7.42 31.2,14.6 32.18,15.58 35.05,15.58 36.01,16.54 36.01,25.68 38.37,28.04 46.64,28.04 49.35,30.75 55.24,30.75 v59.3,34.82
VALIM  (via drill 0.6)
  Top 0.508: v63.46,51.28 65.49,53.31 75.09,53.31 77.2,51.2 77.2,48.58 U1.7
  Bottom 0.508: R24.1 46.65,57.46 C20.1 48.94,57.44 Q3.2 49.06,54.94 52.72,51.28 v63.46,51.28
VBAT  (via drill 0.6)
  Top 0.508: U1.6 78.51,51.31 v78,51.82 | Q5.2 63.79,55.59 64.67,54.7 65.74,54.7 v66.06,55.02
  Bottom 0.508: 70.46,56.86 C21.1 67.9,56.86 v66.06,55.02 | 70.46,56.86 R28.1 | v78,51.82 75.98,53.85 72.14,53.85 70.46,55.52 70.46,56.86
VCC  (via drill 0.6)
  Top 0.152: 35.55,57.91 Q1.2 | R2.2
  Top 0.508: 70.24,58.93 R2.2 | R20.2 67.91,58.93 | 35.55,57.91 | 83.66,50.74 83.59,50.8
  Top 1.016: 67.91,58.93 70.24,58.93 71.63,58.93 72.64,57.91 80.77,57.91 83.59,55.09 83.59,50.8 U1.2 | R20.2 67.33,58.88 66.82,59.39 54.48,59.39 52.96,57.87 | v48.2,51.28 49.72,51.28 52.77,54.32 52.77,57.68 52.96,57.87 | 35.55,58.55 36.21,59.21 R5.2 39.52,59.21 39.8,59.48 51.35,59.48 52.96,57.87 | 35.55,58.55 35.55,57.91 | 35.55,58.55 34.57,59.53 Q4.2 | 83.66,50.74 v84.87,50.74
  Bottom 0.508: R1.1 79.84,29.56 | 23.63,3.88 23.63,31.64
  Bottom 1.016: v84.87,50.74 84.87,48.2 81.78,45.11 C2.1 C1.1 81.78,34.32 79.84,32.38 R1.1 | 79.84,29.56 81.1,28.31 83.21,28.31 85.12,26.4 85.12,20.11 83.42,18.41 JP6.3 | v48.2,51.28 v48.2,51.27 42.26,51.27 C14.1 C15.1 36.68,51.78 | U5.4 36.19,54.13 36.68,53.65 36.68,51.78 | TC1.P$1 24.92,2.59 23.63,3.88 | 23.63,31.64 30.8,38.81 30.8,45.9 36.68,51.78

### Text on the board
tNames: Dtr | Rx | Tx | Vcc | Rts | GND